# Altium project A1_v40.PrjPcb
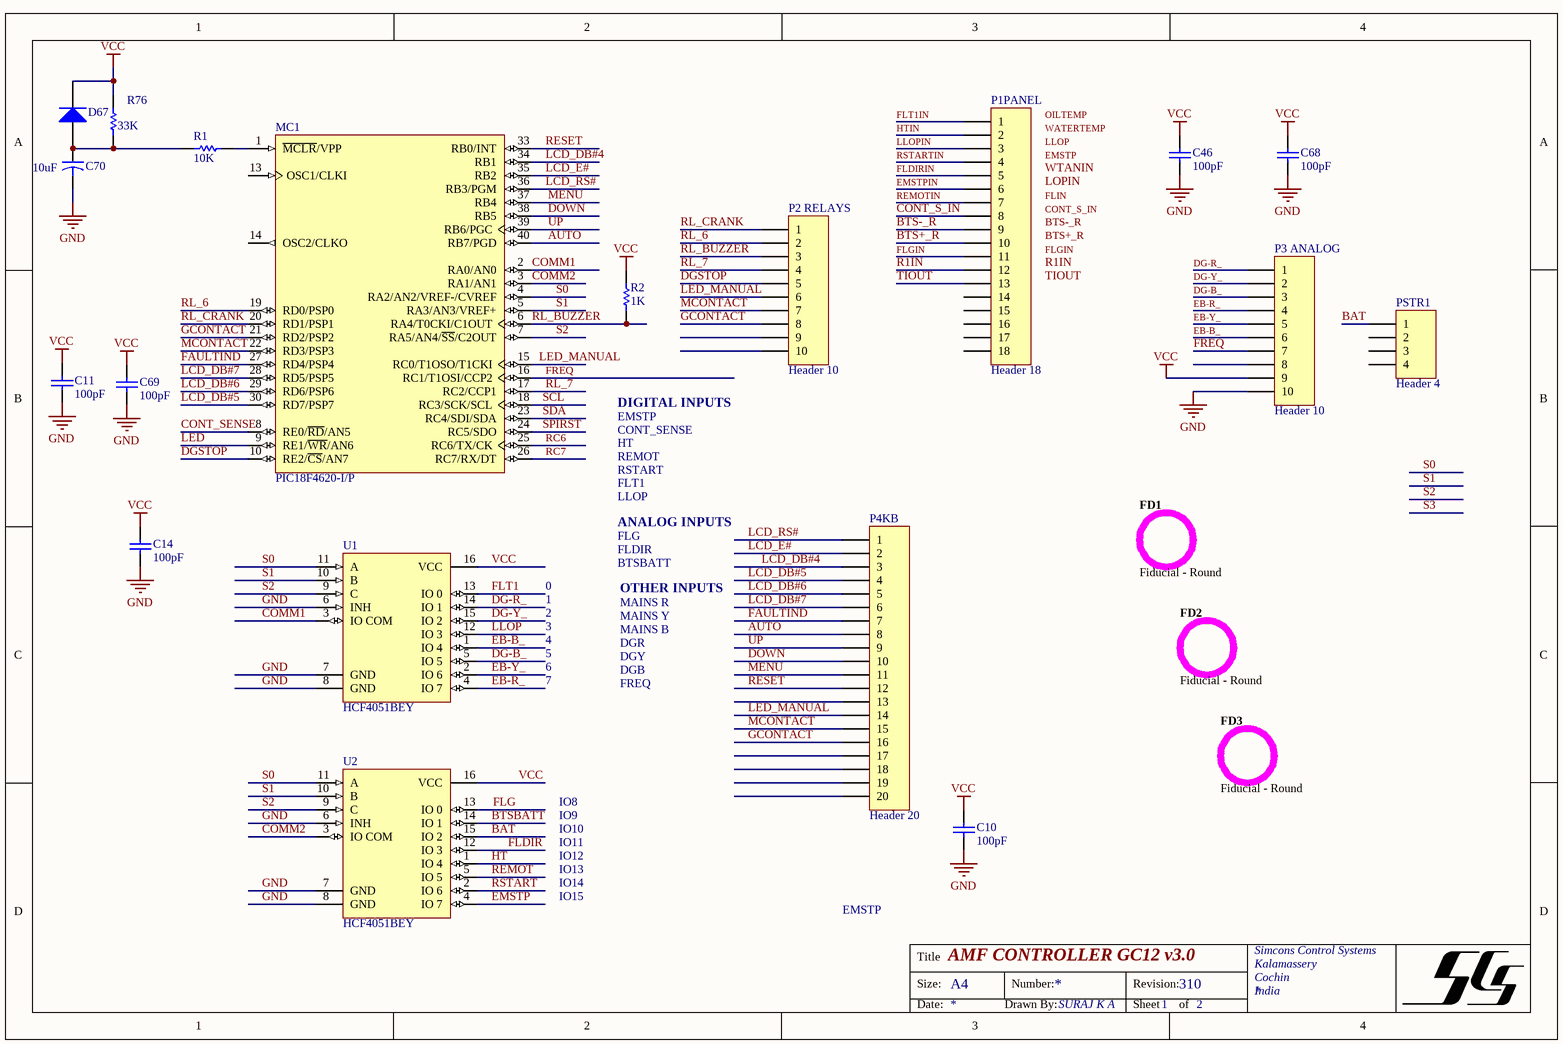
[diagram p0: PROCESSORv35.SchDoc]
2 sheets, 81 parts. Net scope: global (net labels, ports and power ports of the same name join across sheets).
Board file: A1_v40.PcbDoc
Sheets:
  PROCESSORv35.SchDoc
  IO_v35.SchDoc

## Sheet PROCESSORv35.SchDoc: AMF CONTROLLER GC12 v3.0
size A4; Date: MAR 2013; DrawnBy: SURAJ K A; Engineer: SURAJ K A; Revision: 310; SheetNumber: 1; SheetTotal: 2; DocumentName: AMFR

### Parts
C10  value 100pF  [C1206]  (hidden comment: .1uF 1206)
C11  value 100pF  [C1206]  (hidden comment: .1uF 1206)
C14  value 100pF  [C1206]  (hidden comment: 1uF 1206)
C46  value 100pF  [C1206]  (hidden comment: .1uF 1206)
C68  value 100pF  [Cap_.1]  (hidden comment: 100uF/25V)
C69  value 100pF  [C1206]  (hidden comment: .1uF 1206)
C70  value 10uF  [C1206]  (hidden comment: 1uF 1206)
D67  1N4148 SMD  [4148SMDW]  (value not drawn)
FD1  Fiducial - Round  [FIDUCIAL 2mm]
FD2  Fiducial - Round  [FIDUCIAL 2mm]
FD3  Fiducial - Round  [FIDUCIAL 2mm]
MC1  PIC18F4620-I/P  [PDIP600-P40]
P1PANEL  Header 18  [HDR1X18_BURGE_F]
P2_RELAYS  Header 10  [HDR1X10_BURGE_F]
P3_ANALOG  Header 10  [HDR1X10_BURGE_F]
P4KB  Header 20  [HDR1X20_BURGE_F]
PSTR1  Header 4  [HDR1X4_BURGE_F]
R1  value 10K  [R1206]  (hidden comment: 4.7K 1206)
R2  value 1K  [R1206]  (hidden comment: 4.7K 1206)
R76  value 33K  [R1206]  (hidden comment: 100K 1206)
U1  HCF4051BEY  [DIP16]
U2  HCF4051BEY  [DIP16]

### Nets
GND: C10.1 C11.1 C14.1 C46.1 C68.2 C69.1 C70.2 MC1.12(VSS) MC1.31(VSS) P3_ANALOG.10 U1.6(INH) U1.7(GND) U1.8(GND) U2.6(INH) U2.7(GND) U2.8(GND)
VCC: C10.2 C11.2 C14.2 C46.2 C68.1 C69.2 D67.2(K) MC1.11(VDD) MC1.32(VDD) P3_ANALOG.9 R2.2 R76.1 U1.16(VCC) U2.16(VCC)
AUTO: MC1.40(RB7/PGD) P4KB.8
BAT: PSTR1.1 U2.15(IO_2)
BTS+_R: P1PANEL.10
BTS-_R: P1PANEL.9
BTSBATT: U2.14(IO_1)
COMM1: MC1.2(RA0/AN0) U1.3(IO_COM)
COMM2: MC1.3(RA1/AN1) U2.3(IO_COM)
CONT_S_IN: P1PANEL.8
CONT_SENSE: MC1.8(RE0/~{RD}/AN5)
DG-B_: P3_ANALOG.3 U1.5(IO_5)
DG-R_: P3_ANALOG.1 U1.14(IO_1)
DG-Y_: P3_ANALOG.2 U1.15(IO_2)
DGSTOP: MC1.10(RE2/~{CS}/AN7) P2_RELAYS.5
DOWN: MC1.38(RB5) P4KB.10
EB-B_: P3_ANALOG.6 U1.1(IO_4)
EB-R_: P3_ANALOG.4 U1.4(IO_7)
EB-Y_: P3_ANALOG.5 U1.2(IO_6)
EMSTP: U2.4(IO_7)
EMSTPIN: P1PANEL.6
FAULTIND: MC1.27(RD4/PSP4) P4KB.7
FLDIR: U2.12(IO_3)
FLDIRIN: P1PANEL.5
FLG: U2.13(IO_0)
FLGIN: P1PANEL.11
FLT1: U1.13(IO_0)
FLT1IN: P1PANEL.1
FREQ: MC1.16(RC1/T1OSI/CCP2) P3_ANALOG.7
GCONTACT: MC1.21(RD2/PSP2) P2_RELAYS.8 P4KB.16
HT: U2.1(IO_4)
HTIN: P1PANEL.2
LCD_DB#4: MC1.34(RB1) P4KB.3
LCD_DB#5: MC1.30(RD7/PSP7) P4KB.4
LCD_DB#6: MC1.29(RD6/PSP6) P4KB.5
LCD_DB#7: MC1.28(RD5/PSP5) P4KB.6
LCD_E#: MC1.35(RB2) P4KB.2
LCD_RS#: MC1.36(RB3/PGM) P4KB.1
LED: MC1.9(RE1/~{WR}/AN6)
LED_MANUAL: MC1.15(RC0/T1OSO/T1CKI) P2_RELAYS.6 P4KB.14
LLOP: U1.12(IO_3)
LLOPIN: P1PANEL.3
MCONTACT: MC1.22(RD3/PSP3) P2_RELAYS.7 P4KB.15
MENU: MC1.37(RB4) P4KB.11
R1IN: P1PANEL.12
RC6: MC1.25(RC6/TX/CK)
RC7: MC1.26(RC7/RX/DT)
REMOT: U2.5(IO_5)
REMOTIN: P1PANEL.7
RESET: MC1.33(RB0/INT) P4KB.12
RL_6: MC1.19(RD0/PSP0) P2_RELAYS.2
RL_7: MC1.17(RC2/CCP1) P2_RELAYS.4
RL_BUZZER: MC1.6(RA4/T0CKI/C1OUT) P2_RELAYS.3 R2.1
RL_CRANK: MC1.20(RD1/PSP1) P2_RELAYS.1
RSTART: U2.2(IO_6)
RSTARTIN: P1PANEL.4
S0: MC1.4(RA2/AN2/VREF-/CVREF) U1.11(A) U2.11(A)
S1: MC1.5(RA3/AN3/VREF+) U1.10(B) U2.10(B)
S2: MC1.7(RA5/AN4/~{SS}/C2OUT) U1.9(C) U2.9(C)
SCL: MC1.18(RC3/SCK/SCL)
SDA: MC1.23(RC4/SDI/SDA)
SPIRST: MC1.24(RC5/SDO)
TIOUT: P1PANEL.13
UP: MC1.39(RB6/PGC) P4KB.9
NetC70_1: C70.1 D67.1(A) R1.2 R76.2
NetMC1_1: MC1.1(~{MCLR}/VPP) R1.1

Not connected (* = marked no-connect by the designer): MC1 13(OSC1/CLKI) 14(OSC2/CLKO); P1PANEL 14 15 16 17 18; P2_RELAYS 9 10; P3_ANALOG 8; P4KB 13 17 18 19 20; PSTR1 2 3 4

### Notes on the sheet
- DIGITAL INPUTS
- EMSTP
- CONT_SENSE
- HT
- REMOT
- RSTART
- FLT1
- LLOP
- ANALOG INPUTS
- 0
- FLG
- FLDIR
- BTSBATT
- OTHER INPUTS
- 1
- 2
- 3
- 4
- 5
- MAINS R
- MAINS Y
- MAINS B
- DGR
- DGY
- 6
- 7
- DGB
- FREQ
- IO8
- IO9
- IO10
- IO11
- IO12
- IO13
- IO14
- IO15
- Labels drawn without touching a wire or pin: BTS+_R, BTS-_R, CONT_S_IN, EMSTP, FLGIN, FLIN, LLOP, LOPIN, OILTEMP, R1IN, TIOUT, WATERTEMP, WTANIN
- Title
- Size:
- A4
- Number:
- Revision:
- Simcons Control Systems
- Kalamassery
- Cochin
- India
- Date:
- Drawn By:
- SURAJ K A
- Sheet
- of

### Library data of the parts
C10 C11 C14 C46 C68 C69 = Cap: Capacitor; Published: 8-Jun-2000; LatestRevisionDate: 17-Jul-2002; LatestRevisionNote: Re-released for DXP Platform.; PackageReference: RAD-0.3; Publisher: Altium Limited; PackageDescription: Radial Cap, Thru-Hole; 2 Leads; 0.3 in Pin Spacing
C70 = Cap2: Capacitor; Published: 23-Sep-2002; PackageReference: CAPR5-4X5; Publisher: Altium Limited; PackageDescription: Capacitor; 2 Leads
D67 = Diode 1N4001: 1 Amp General Purpose Rectifier; Published: 8-Jun-2000; LatestRevisionDate: 17-Jul-2002; LatestRevisionNote: Re-released for DXP Platform.; DatasheetVersion: 1998; PackageVersion: Aug-1999; PackageReference: DO-41; Publisher: Altium Limited; PackageDescription: Diode, Axial; Body 5.2 x 2.7 mm (LxDia. max), Lead Dia. 0.86 mm (max); Code_JEDEC: DO-204-AL; ComponentLink1Description: Manufacturer Link; ComponentLink1URL: http://www.fairchildsemi.com/; ComponentLink2Description: Datasheet; ComponentLink2URL: http://www.fairchildsemi.com/ds/1N%2F1N4001.pdf
FD1-FD3 = FIDUCIAL ROUND: Fiducial - Round 1.5mm Top-Bottom; Status: Unreleased; Category: Graphic-PCB
MC1 = PIC16F877A-I/P: Enhanced FLASH Microcontroller, 8K (x14-Bit words) FLASH, 368 Bytes RAM, 40-Pin PDIP, Standard VDD Range, Industrial Temperature; ComponentAvailability: Unknown. Contact manufacturer to determine status.; Published: 11-Oct-2004; LatestRevisionDate: 29-Jan-2009; LatestRevisionNote: Sch. layout revised. 3D Model Removed.; DatasheetVersion: revB, Oct-2003; PackageVersion: revBB, Aug-2009; PackageReference: PDIP600-P40; Publisher: Altium Limited; PackageDescription: 40-Lead Plastic Dual In-Line (P) - 600 mil Body [PDIP]; Supplier 1: Digi-Key; Supplier Part Number 1: PIC16F877A-I/P-ND; Supplier 2: Farnell; Supplier Part Number 2: 1523966; Supplier 3: Farnell; Supplier Part Number 3: 9761446; ComponentLink1Description: Datasheet; ComponentLink1URL: http://ww1.microchip.com/downloads/en/DeviceDoc/39582b.pdf; ComponentLink2Description: Packaging Specification; ComponentLink2URL: http://www.microchip.com/stellent/groups/techpub_sg/documents/packagingspec/en012702.pdf; ComponentLink3Description: Microchip.com Home; ComponentLink3URL: http://www.microchip.com/
P1PANEL = Header 18: Header, 18-Pin; LatestRevisionDate: 17-Jul-2002; LatestRevisionNote: Re-released for DXP Platform.; Publisher: Altium Limited
P2_RELAYS P3_ANALOG = Header 10: Header, 10-Pin; LatestRevisionDate: 17-Jul-2002; LatestRevisionNote: Re-released for DXP Platform.; Publisher: Altium Limited
P4KB = Header 20: Header, 20-Pin; LatestRevisionDate: 17-Jul-2002; LatestRevisionNote: Re-released for DXP Platform.; Publisher: Altium Limited
PSTR1 = Header 4: Header, 4-Pin; LatestRevisionDate: 17-Jul-2002; LatestRevisionNote: Re-released for DXP Platform.; Publisher: Altium Limited
R1 R2 R76 = Res1: Resistor; Published: 8-Jun-2000; LatestRevisionDate: 17-Jul-2002; LatestRevisionNote: Re-released for DXP Platform.; Publisher: Altium Limited; PackageDescription: Axial Device, Thru-Hole; 2 Leads; 0.3 in Pin Spacing
  R1 R76: PackageReference: AXIAL-0.4
  R2: PackageReference: AXIAL-0.3
U1 U2 = HCF4051BEY: Analog Multiplexer/Demultiplexer; Published: 8-Jun-2000; LatestRevisionDate: 06-Jun-2005; LatestRevisionNote: Stylized 3D Model Added.; DatasheetVersion: Jun-1989; PackageVersion: Apr-1996; PackageReference: DIP16; Publisher: Altium Limited; PackageDescription: DIP; 16 Leads; Row Spacing 7.62 mm; Pitch 2.54 mm; ComponentLink1Description: Manufacturer Link; ComponentLink1URL: http://www.st.com/; ComponentLink2Description: Datasheet; ComponentLink2URL: http://www.st.com/stonline/products/literature/ds/2053/hcf4051.pdf

## Sheet IO_v35.SchDoc: AMF CONTROLLER GC12
size A4; Date: NOV 2011; DrawnBy: SURAJ; Engineer: SURAJ K A; Revision: 310; SheetNumber: 2; SheetTotal: 2
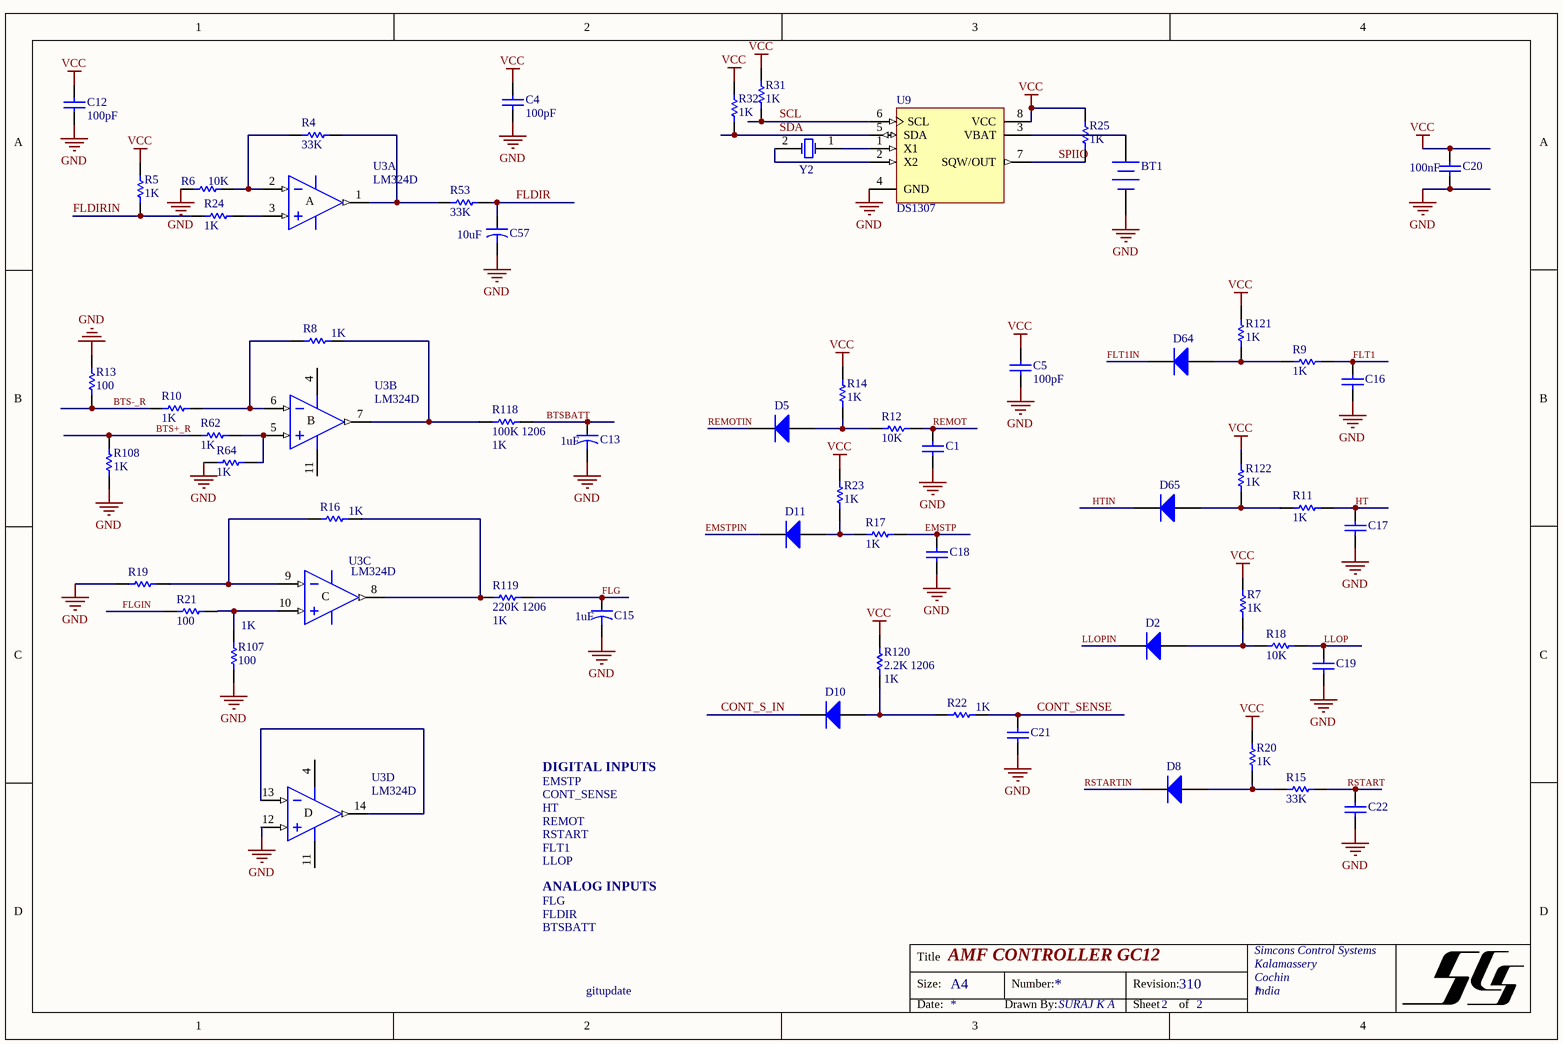
[diagram p1: IO_v35.SchDoc]

### Parts
BT1  CR2032  [CELL_HOLDER]  (value not drawn)
C1  .1uF 1206  [C1206]  (value not drawn)
C4  value 100pF  [C1206]  (hidden comment: .1uF 1206)
C5  value 100pF  [C1206]  (hidden comment: .1uF 1206)
C12  value 100pF  [C1206]  (hidden comment: .1uF 1206)
C13  value 1uF  [C1206]  (hidden comment: 1uF 1206)
C15  value 1uF  [C1206]  (hidden comment: 1uF 1206)
C16  .1uF 1206  [C1206]  (value not drawn)
C17  .1uF 1206  [C1206]  (value not drawn)
C18  .1uF 1206  [C1206]  (value not drawn)
C19  .1uF 1206  [C1206]  (value not drawn)
C20  value 100nF  [C1206]  (hidden comment: .1uF 1206)
C21  .1uF 1206  [C1206]  (value not drawn)
C22  .1uF 1206  [C1206]  (value not drawn)
C57  value 10uF  [C1206]  (hidden comment: 1uF 1206)
D2  1N4148 SMD  [4148SMDW]  (value not drawn)
D5  1N4148 SMD  [4148SMDW]  (value not drawn)
D8  1N4148 SMD  [4148SMDW]  (value not drawn)
D10  1N4148 SMD  [4148SMDW]  (value not drawn)
D11  1N4148 SMD  [4148SMDW]  (value not drawn)
D64  1N4148 SMD  [4148SMDW]  (value not drawn)
D65  1N4148 SMD  [4148SMDW]  (value not drawn)
R4  value 33K  [R1206]  (hidden comment: 220K 1206)
R5  value 1K  [R1206]  (hidden comment: 1K 1206)
R6  value 10K  [R1206]  (hidden comment: 100K 1206)
R7  value 1K  [R1206]  (hidden comment: 2.2K 1206)
R8  value 1K  [R1206]  (hidden comment: 1M 1206)
R9  value 1K  [R1206]  (hidden comment: 100K 1206)
R10  value 1K  [R1206]  (hidden comment: 1M 1206)
R11  value 1K  [R1206]  (hidden comment: 100K 1206)
R12  value 10K  [R1206]  (hidden comment: 100K 1206)
R13  value 100  [R1206]  (hidden comment: 47K 1206)
R14  value 1K  [R1206]  (hidden comment: 2.2K 1206)
R15  value 33K  [R1206]  (hidden comment: 100K 1206)
R16  value 1K  [R1206]  (hidden comment: 220K 1206)
R17  value 1K  [R1206]  (hidden comment: 100K 1206)
R18  value 10K  [R1206]  (hidden comment: 100K 1206)
R19  value 1K  [R1206]  (hidden comment: 220K 1206)
R20  value 1K  [R1206]  (hidden comment: 2.2K 1206)
R21  value 100  [R1206]  (hidden comment: 100K 1206)
R22  value 1K  [R1206]  (hidden comment: 100K 1206)
R23  value 1K  [R1206]  (hidden comment: 2.2K 1206)
R24  value 1K  [R1206]  (hidden comment: 100K 1206)
R25  value 1K  [R1206]  (hidden comment: 100K 1206)
R31  value 1K  [R1206]  (hidden comment: 4.7K 1206)
R32  value 1K  [R1206]  (hidden comment: 4.7K 1206)
R53  value 33K  [R1206]  (hidden comment: 220K 1206)
R62  value 1K  [R1206]  (hidden comment: 1M 1206)
R64  value 1K  [R1206]  (hidden comment: 1M 1206)
R107  value 100  [R1206]  (hidden comment: 220K 1206)
R108  value 1K  [R1206]  (hidden comment: 47K 1206)
R118  100K 1206  value 1K  [R1206]
R119  220K 1206  value 1K  [R1206]
R120  2.2K 1206  value 1K  [R1206]
R121  value 1K  [R1206]  (hidden comment: 2.2K 1206)
R122  value 1K  [R1206]  (hidden comment: 2.2K 1206)
U3  LM324D  [SOIC14_M]  (parts A,B,C,D of 4)
U9  DS1307  [DIP-8]
Y2  XTAL 32.768KHz 6pF  [XTALWATCH]  (value not drawn)

### Nets
GND: BT1.2(-) C1.1 C4.1 C5.1 C12.1 C13.2 C15.2 C16.1 C17.1 C18.1 C19.1 C20.1 C21.1 C22.1 C57.2 R6.2 R13.1 R19.1 R64.1 R107.2 R108.1 U3.11(V-) U3.12(IN+) U9.4(GND)
VCC: C4.2 C5.2 C12.2 C20.2 R5.1 R7.1 R14.1 R20.1 R23.1 R25.1 R31.1 R32.1 R120.2 R121.2 R122.2 U3.4(V+) U9.8(VCC)
BTS+_R: R62.1 R108.2
BTS-_R: R10.1 R13.2
BTSBATT: C13.1 R118.2
CONT_S_IN: D10.2(K)
CONT_SENSE: C21.2 R22.2
EMSTP: C18.2 R17.2
EMSTPIN: D11.2(K)
FLDIR: C57.1 R53.1
FLDIRIN: R5.2 R24.1
FLG: C15.1 R119.2
FLGIN: R21.2
FLT1: C16.2 R9.2
FLT1IN: D64.2(K)
HT: C17.2 R11.2
HTIN: D65.2(K)
LLOP: C19.2 R18.2
LLOPIN: D2.2(K)
REMOT: C1.2 R12.2
REMOTIN: D5.2(K)
RSTART: C22.2 R15.2
RSTARTIN: D8.2(K)
SCL: R31.2 U9.6(SCL)
SDA: R32.2 U9.5(SDA)
SPIIO: R25.2 U9.7(SQW/OUT)
NetBT1_1: BT1.1(+) U9.3(VBAT)
NetD2_1: D2.1(A) R7.2 R18.1
NetD5_1: D5.1(A) R12.1 R14.2
NetD8_1: D8.1(A) R15.1 R20.2
NetD10_1: D10.1(A) R22.1 R120.1
NetD11_1: D11.1(A) R17.1 R23.2
NetD64_1: D64.1(A) R9.1 R121.1
NetD65_1: D65.1(A) R11.1 R122.1
NetR4_1: R4.1 R53.2 U3.1(OUT)
NetR4_2: R4.2 R6.1 U3.2(IN-)
NetR8_1: R8.1 R10.2 U3.6(IN-)
NetR8_2: R8.2 R118.1 U3.7(OUT)
NetR16_1: R16.1 R19.2 U3.9(IN-)
NetR16_2: R16.2 R119.1 U3.8(OUT)
NetR21_1: R21.1 R107.1 U3.10(IN+)
NetR24_2: R24.2 U3.3(IN+)
NetR62_2: R62.2 R64.2 U3.5(IN+)
NetU3_13: U3.13(IN-) U3.14(OUT)
NetU9_1: U9.1(X1) Y2.1(OSC1)
NetU9_2: U9.2(X2) Y2.2(OSC2)

### Notes on the sheet
- DIGITAL INPUTS
- EMSTP
- CONT_SENSE
- HT
- REMOT
- RSTART
- FLT1
- LLOP
- ANALOG INPUTS
- FLG
- FLDIR
- BTSBATT
- gitupdate
- Title
- Size:
- A4
- Number:
- Revision:
- Simcons Control Systems
- Kalamassery
- Cochin
- India
- Date:
- Drawn By:
- SURAJ K A
- Sheet
- of
- (in symbol LM324D, part A) A
- (in symbol LM324D, part B) B
- (in symbol LM324D, part C) C
- (in symbol LM324D, part D) D

### Library data of the parts
BT1 = Battery: Multicell Battery; Published: 24-Mar-1999; LatestRevisionDate: 17-Jul-2002; LatestRevisionNote: Re-released for DXP Platform.; PackageReference: BAT-2; Publisher: Altium Limited; PackageDescription: Battery; 2 Leads
C1 C16-C19 C21 C22 = Cap: Capacitor; Value: 100pF; Published: 8-Jun-2000; LatestRevisionDate: 17-Jul-2002; LatestRevisionNote: Re-released for DXP Platform.; PackageReference: RAD-0.3; Publisher: Altium Limited; PackageDescription: Radial Cap, Thru-Hole; 2 Leads; 0.3 in Pin Spacing
C4 C5 C12 C20 = Cap: Capacitor; Published: 8-Jun-2000; LatestRevisionDate: 17-Jul-2002; LatestRevisionNote: Re-released for DXP Platform.; PackageReference: RAD-0.3; Publisher: Altium Limited; PackageDescription: Radial Cap, Thru-Hole; 2 Leads; 0.3 in Pin Spacing
C13 C15 C57 = Cap2: Capacitor; Published: 23-Sep-2002; PackageReference: CAPR5-4X5; Publisher: Altium Limited; PackageDescription: Capacitor; 2 Leads
D2 D5 D8 D10 D11 D64 D65 = Diode 1N4001: 1 Amp General Purpose Rectifier; Published: 8-Jun-2000; LatestRevisionDate: 17-Jul-2002; LatestRevisionNote: Re-released for DXP Platform.; DatasheetVersion: 1998; PackageVersion: Aug-1999; PackageReference: DO-41; Publisher: Altium Limited; PackageDescription: Diode, Axial; Body 5.2 x 2.7 mm (LxDia. max), Lead Dia. 0.86 mm (max); Code_JEDEC: DO-204-AL; ComponentLink1Description: Manufacturer Link; ComponentLink1URL: http://www.fairchildsemi.com/; ComponentLink2Description: Datasheet; ComponentLink2URL: http://www.fairchildsemi.com/ds/1N%2F1N4001.pdf
R4-R25 R31 R32 R53 R62 R64 R107 R108 = Res1: Resistor; Published: 8-Jun-2000; LatestRevisionDate: 17-Jul-2002; LatestRevisionNote: Re-released for DXP Platform.; PackageReference: AXIAL-0.3; Publisher: Altium Limited; PackageDescription: Axial Device, Thru-Hole; 2 Leads; 0.3 in Pin Spacing
R118-R122 = Res Semi: Semiconductor Resistor; Published: 8-Jun-2000; LatestRevisionDate: 17-Jul-2002; LatestRevisionNote: Re-released for DXP Platform.; PackageReference: AXIAL-0.5; Publisher: Altium Limited; PackageDescription: Axial Device, Thru-Hole; 2 Leads; 0.5 in Pin Spacing
U3 = LM324D: Quadruple Operational Amplifier; Published: 16-Jan-2001; LatestRevisionDate: 13-Apr-2006; LatestRevisionNote: IPC-7351 Footprint Added.; DatasheetVersion: Feb-1997; PackageVersion: Jan-1998; PackageReference: D014; Publisher: Altium Limited; PackageDescription: 14-Pin Small Outline Integrated Circuit 1.27 mm Pitch; Code_IPC: SOIC127P600-14; ComponentLink1Description: Manufacturer Link; ComponentLink1URL: http://www.ti.com/; ComponentLink2Description: Datasheet; ComponentLink2URL: http://www-s.ti.com/sc/ds/lm324.pdf
U9 = DS1307: 64 X 8 Serial Real-Time Clock; Published: 13-Oct-2000; LatestRevisionDate: 17-Jul-2002; LatestRevisionNote: Re-released for DXP Platform.; DatasheetVersion: 10-Aug-1999; PackageVersion: 1999; PackageReference: DIP8; Publisher: Altium Limited; PackageDescription: DIP, 8-Pin, Row Spacing 7.62 mm, Pitch 2.54 mm; ComponentLink1Description: Manufacturer Link; ComponentLink1URL: http://www.maxim-ic.com/; ComponentLink2Description: Datasheet; ComponentLink2URL: http://pdfserv.maxim-ic.com/en/ds/DS1307.pdf; ComponentLink3Description: Discontinuation Notice; ComponentLink3URL: http://www.maxim-ic.com/qa/pdfs/non-obsolescence-letter.pdf
Y2 = XTAL: Crystal Oscillator; Published: 8-Jun-2000; LatestRevisionDate: 17-Jul-2002; LatestRevisionNote: Re-released for DXP Platform.; PackageReference: R38; Publisher: Altium Limited; PackageDescription: Crystal, Thru-Hole; 2 Leads; Body 3.1 x 8.2 mm (Dia.xH)

## Nets that join several sheets
GND: PROCESSORv35 (16 pins), IO_v35 (24 pins)
VCC: PROCESSORv35 (14 pins), IO_v35 (17 pins)
BTS+_R: PROCESSORv35 (P1PANEL.10), IO_v35 (R62.1 R108.2)
BTS-_R: PROCESSORv35 (P1PANEL.9), IO_v35 (R10.1 R13.2)
BTSBATT: PROCESSORv35 (U2.14), IO_v35 (C13.1 R118.2)
CONT_S_IN: PROCESSORv35 (P1PANEL.8), IO_v35 (D10.2)
CONT_SENSE: PROCESSORv35 (MC1.8), IO_v35 (C21.2 R22.2)
EMSTP: PROCESSORv35 (U2.4), IO_v35 (C18.2 R17.2)
EMSTPIN: PROCESSORv35 (P1PANEL.6), IO_v35 (D11.2)
FLDIR: PROCESSORv35 (U2.12), IO_v35 (C57.1 R53.1)
FLDIRIN: PROCESSORv35 (P1PANEL.5), IO_v35 (R5.2 R24.1)
FLG: PROCESSORv35 (U2.13), IO_v35 (C15.1 R119.2)
FLGIN: PROCESSORv35 (P1PANEL.11), IO_v35 (R21.2)
FLT1: PROCESSORv35 (U1.13), IO_v35 (C16.2 R9.2)
FLT1IN: PROCESSORv35 (P1PANEL.1), IO_v35 (D64.2)
HT: PROCESSORv35 (U2.1), IO_v35 (C17.2 R11.2)
HTIN: PROCESSORv35 (P1PANEL.2), IO_v35 (D65.2)
LLOP: PROCESSORv35 (U1.12), IO_v35 (C19.2 R18.2)
LLOPIN: PROCESSORv35 (P1PANEL.3), IO_v35 (D2.2)
REMOT: PROCESSORv35 (U2.5), IO_v35 (C1.2 R12.2)
REMOTIN: PROCESSORv35 (P1PANEL.7), IO_v35 (D5.2)
RSTART: PROCESSORv35 (U2.2), IO_v35 (C22.2 R15.2)
RSTARTIN: PROCESSORv35 (P1PANEL.4), IO_v35 (D8.2)
SCL: PROCESSORv35 (MC1.18), IO_v35 (R31.2 U9.6)
SDA: PROCESSORv35 (MC1.23), IO_v35 (R32.2 U9.5)